# Altium schematic sheet pwm_generator.SchDoc
size A4; Author: Omri Nissan; Organization: Altium Limited; Address1: -; Address2: San Luis Obispo; Address3: California, 93401; Address4: United States; DocumentNumber: 6; SheetNumber: 6; SheetTotal: 8
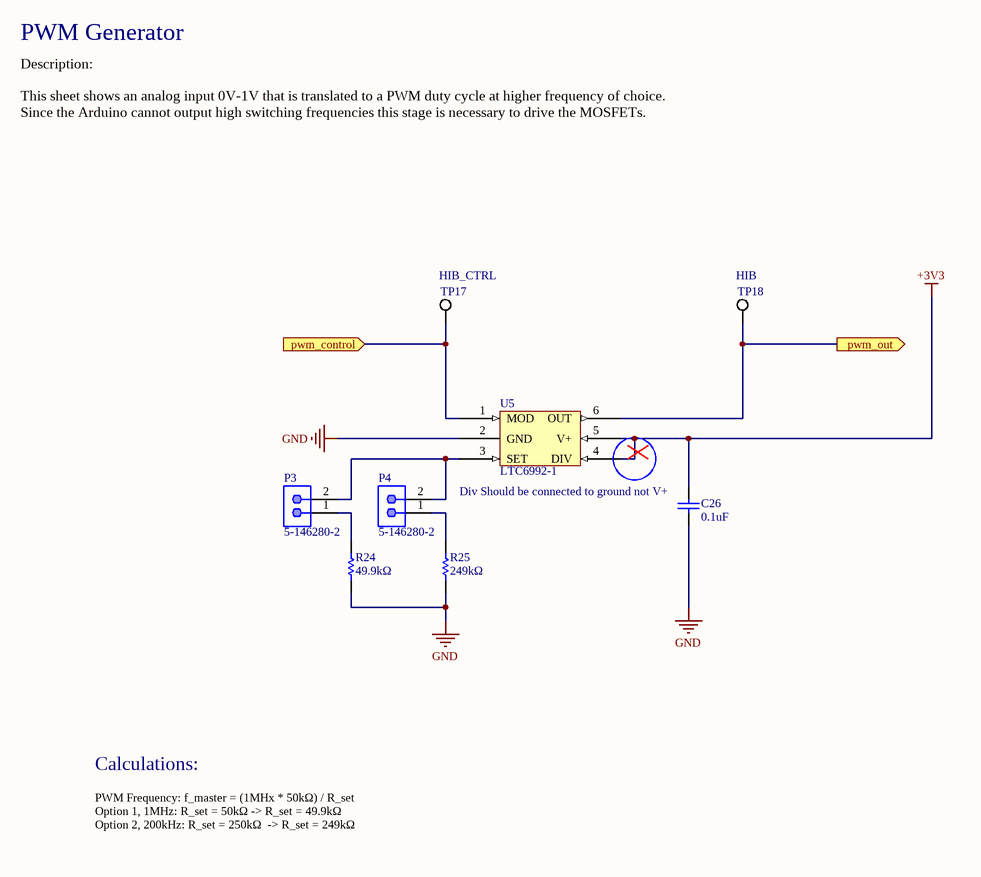
[diagram p0: pwm_generator.SchDoc]

## Parts
C26  0.1uF  [CAPC1608X90X35ML10T15]
P3  5-146280-2  [TECO-5-146280-2_V]
P4  5-146280-2  [TECO-5-146280-2_V]
R24  49.9kΩ  [RESC1609X55X30ML10T20]
R25  249kΩ  [RESC1609X55X30LL10T20]
TP17  HIB_CTRL  [KSTN-5012_V]
TP18  HIB  [KSTN-5012_V]
U5  LTC6992-1  [LT-S6-6-TSOT-23_L]

## Ports
pwm_control (in), pwm_out (out)

## Nets
+3V3: C26.2 U5.4(DIV) U5.5(V+)
GND: C26.1 R24.1 R25.1 U5.2(GND)
pwm_control: TP17.1 U5.1(MOD) ; port pwm_control
pwm_out: TP18.1 U5.6(OUT) ; port pwm_out
NetP3_1: P3.1 R24.2
NetP3_2: P3.2 P4.2 U5.3(SET)
NetP4_1: P4.1 R25.2

## Notes on the sheet
- PWM Generator
- Description:
  This sheet shows an analog input 0V-1V that is translated to a PWM duty cycle at higher frequency of choice. Since the Arduino cannot output high switching frequencies this stage is necessary to drive the MOSFETs.
- (near C26) Div Should be connected to ground not V+
- Calculations:
- PWM Frequency: f_master = (1MHx * 50kΩ) / R_set
  Option 1, 1MHz: R_set = 50kΩ -> R_set = 49.9kΩ
  Option 2, 200kHz: R_set = 250kΩ  -> R_set = 249kΩ
- Title
- Size:
- Date:
- A4
- Number:
- Time:
- Revision:
- Sheet
- of
- File:

## Library data of the parts
C26 = CMP-2100-03643-1: GRM188R71H104KA93D - Chip Capacitor, 0.1 uF, +/- 10%, 50 V, -55 to 125 degC, 0603 (1608 Metric), RoHS, Tape and Reel; Manufacturer: Murata; Dielectric Material: Ceramic; Voltage Rating: 50V; Capacitance: 100nF; Dielectric: X7R; Insulation Resistance: 10GR; Case Code (Metric): 1608; Lead Free: LeadFree; Depth: 0.8mm; Number of Pins: 2; Radiation Hardening: No; Case/Package: 0603; Manufacturer URL: http://www.murata.com/; Packaging: TapeandReel; Length: 1.6mm; Contact Plating: Tin; Datasheet URL: http://psearch.en.murata.com/capacitor/product/GRM188R71H104KA93%23.pdf; Tolerance: 10%; Case Code (Imperial): 0603; Min Operating Temperature: -55degC; RoHSCompliant: true; Voltage: 50V; Termination: SMD/SMT; Mount: SurfaceMount; Material: Ceramic; Package Quantity: 1; Height: 0.8mm; Thickness: 0.035inch; REACH SVHC: NoSVHC; Max Operating Temperature: 125degC; Width: 0.8mm; Package Reference: 0603; Voltage Rating (DC): 50V; Datasheet Version: 42675.0; Package Description: 2-Pin Surface Mount Device, Body 1.6 x 0.8 mm
P3 P4 = CMP-2000-07492-1: Male Header, Pitch 2.54 mm, 1 x 2 Position, Height 8.21 mm, Tail Length 3.05 mm, -65 to 105 degC, RoHS, Bulk; Manufacturer: TE Connectivity; Mating Connector Lock: No(Without); Number of Positions: 2; Pitch: 2.54mm; PCB Mounting Orientation: Vertical; Keyed: No; Case\/Package: 100; Mating Post Length: 0.23inch; High Temperature Housing: Yes; Max Current Rating: 5A; PCB Thickness: 0.063inch; PCB Mount Retention: Without; Approvals: CSA; Current Rating: 3A; Radiation Hardening: No; Length: 4.67mm; Contact Mating Length: 0.23inch; Connector Type: Header; Number of Rows: 1; Termination Post Length: 0.12inch; Board Standoff: No(Without); Max Operating Temperature: 105degC; Contact Shape: Square; Selectively Loaded: No(Without); Gasket: No(Without); Number of Contacts: 2; Contact Gender: Male; Mating Alignment: No(Without); Manufacturer URL: http://www.te.com/; Datasheet URL: http://www.te.com/commerce/DocumentDelivery/DDEController?Action=showdoc&DocId=Customer+Drawing%7F146280%7FH1%7Fpdf%7FEnglish%7FENG_CD_146280_H1.pdf%7F5-146280-2; Mount: ThroughHole; Orientation: Straight; Packaging: Carton; Package Reference: 5-146280-2; Package Quantity: 500; Stabilizers: No(Without); Row Spacing: 2.54mm; Contact Material: CopperAlloy; Panel Mount Retention: No(Without); Datasheet Version: Rev. H1, 08/2016; Housing Colour: Black; Colour: Black; Package Description: Male Header, Pitch 2.54 mm, 1 x 2 Position, Height 8.21 mm, Tail Length 3.05 mm; Contact Plating: Matte; Housing Material: Polymer; Contact Protection: No(Without); Min Operating Temperature: -65degC; Mounting Technology: ThroughHole; Flammability Rating: UL94V-0; RoHSCompliant: true; Termination: ThroughHole; Depth: 2.34mm; High Speed Serial Data Connector: No
R24 = CMP-2000-03773-1: TNPW060349K9BEEN; Manufacturer: Vishay Dale; Part Number: TNPW060349K9BEEN
R25 = CMP-2000-03736-1: TNPW0603249KBEEA; Manufacturer: Vishay Dale; Part Number: TNPW0603249KBEEA
TP17 TP18 = CMP-1672-00004-4: Test Point, White, Through Hole, RoHS, Bulk; Manufacturer: Keystone; DatasheetVersion: Rev. F, 12/2013; ComponentLink1URL: http://www.keyelco.com/; PackageReference: 5012; RoHSCompliant: true; ComponentLink2Description: Datasheet; Colour: White; Contact Material: Bronze; PackageDescription: 1-Pin Through Hole Device, Dia 3.17 mm; Mounting Technology: Through Hole; Mount: Through Hole; Package Quantity: 100; ComponentLink1Description: Manufacturer URL; Pins: 1; Height: 8.12 mm; Packaging: Bulk; REACH SVHC: No SVHC; Contact Plating: Silver; Length: 11.3 mm; ComponentLink2URL: http://www.keyelco.com/product-pdf.cfm?p=1321
U5 = LTC6992-1: Oscillator, Silicon IC 3.81Hz ~ 1MHz TSOT-23-6; Manufacturer 1: Analog Devices; Manufacturer Part Number 1: LTC6992IS6-1#TRMPBF; Operating Supply Current: 365uA; Supplier 1: Digi-Key; Stock 1: 9940; Pricing 1: 1=4.57000, 25=3.03440, 100=2.50910, 250=2.38364 (USD); Mount: Surface Mount; Case/Package: SOT-23-6; Number of Pins: 23; Min Operating Temperature: -40°C; Max Operating Temperature: 85°C; Packaging: Tape and Reel; Package Quantity: 500; Frequency: 3.81Hz; Length: 2.9mm; Depth: 1.75mm; Radiation Hardening: No; Lead Free: Lead Free; ComponentLink1URL: https://datasheet.ciiva.com/15116/getdatasheetpartid-411031-15116193.pdf?src-supplier=Verical; ComponentLink1Description: https://datasheet.ciiva.com/15116/getdatasheetpartid-411031-15116193.pdf?src-supplier=Verical; ComponentLink2URL: https://datasheet.ciiva.com/6668/29337-6668309.pdf?src-supplier=Digi-Key; ComponentLink2Description: https://datasheet.ciiva.com/6668/29337-6668309.pdf?src-supplier=Digi-Key; ComponentLink3URL: https://datasheet.ciiva.com/6668/29337-6668312.pdf?src-supplier=Digi-Key; ComponentLink3Description: https://datasheet.ciiva.com/6668/29337-6668312.pdf?src-supplier=Digi-Key; ComponentLink4URL: https://datasheet.ciiva.com/6668/29337-6668316.pdf?src-supplier=Digi-Key; ComponentLink4Description: https://datasheet.ciiva.com/6668/29337-6668316.pdf?src-supplier=Digi-Key; ComponentLink5URL: http://datasheet.octopart.com/LTC6992IS6-1%23TRMPBF-Linear-Technology-datasheet-10978009.pdf?src-supplier=Linear+Technology; ComponentLink5Description: http://datasheet.octopart.com/LTC6992IS6-1%23TRMPBF-Linear-Technology-datasheet-10978009.pdf?src-supplier=Linear+Technology; ComponentLink6URL: http://sigma.octopart.com/57691988/technical_drawing/Linear-Technology-LTC6992IS6-1%23TRMPBF.pdf?src-supplier=Linear+Technology; ComponentLink6Description: http://sigma.octopart.com/57691988/technical_drawing/Linear-Technology-LTC6992IS6-1%23TRMPBF.pdf?src-supplier=Linear+Technology; Supplier Part Number 1: LTC6992IS6-1#TRMPBFCT-ND